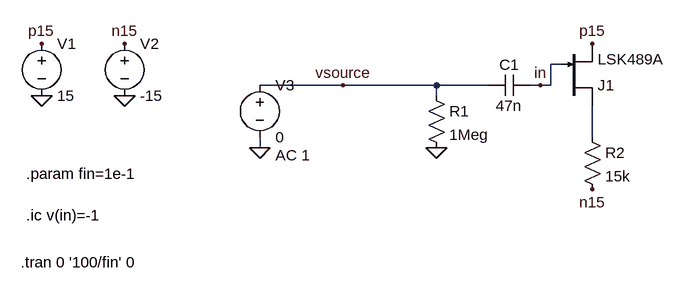
[diagram p0: schematic Draft1.asc]
Draft1.asc, the LTspice schematic file:
Version 4.1
SHEET 1 1416 680
WIRE 480 208 464 208
WIRE 144 240 16 240
WIRE 288 240 144 240
WIRE 368 240 288 240
WIRE 448 240 432 240
WIRE 464 240 464 208
WIRE 464 240 448 240
WIRE 288 256 288 240
WIRE 528 320 528 272
WIRE 16 336 16 320
FLAG -320 256 0
FLAG -192 256 0
FLAG -320 176 p15
FLAG -192 176 n15
FLAG 528 176 p15
FLAG 528 400 n15
FLAG 288 336 0
FLAG 16 336 0
FLAG 448 240 in
FLAG 144 240 vsource
SYMBOL res 272 240 R0
SYMATTR InstName R1
SYMATTR Value 1Meg
SYMBOL cap 432 224 R90
WINDOW 0 0 32 VBottom 2
WINDOW 3 32 32 VTop 2
SYMATTR InstName C1
SYMATTR Value 47n
SYMBOL njf 480 272 M180
SYMATTR InstName J1
SYMATTR Value LSK489A
SYMBOL voltage -320 160 R0
WINDOW 123 0 0 Left 0
WINDOW 39 0 0 Left 0
SYMATTR InstName V1
SYMATTR Value 15
SYMBOL voltage -192 160 R0
WINDOW 123 0 0 Left 0
WINDOW 39 0 0 Left 0
SYMATTR InstName V2
SYMATTR Value -15
SYMBOL res 512 304 R0
SYMATTR InstName R2
SYMATTR Value 15k
SYMBOL voltage 16 224 R0
WINDOW 123 24 124 Left 2
WINDOW 39 0 0 Left 0
SYMATTR InstName V3
SYMATTR Value 0
SYMATTR Value2 AC 1
TEXT -352 512 Left 2 !.tran 0 '100/fin' 0
TEXT -344 440 Left 2 !.ic v(in)=-1
TEXT -344 376 Left 2 !.param fin=1e-1

The netlist it stands for:
* Draft1.asc
R1 vsource 0 1Meg
C1 in vsource 47n
J1 N001 in p15 LSK489A
V1 p15 0 15
V2 n15 0 -15
R2 N001 n15 15k
V3 vsource 0 0 AC 1
.model NJF NJF
.model PJF PJF
.lib standard.jft
.tran 0 '100/fin' 0
.ic v(in)=-1
.param fin=1e-1
.backanno
.end